# EAGLE design eCog101_I2C_TFT_.96 (EAGLE 6.6.0)
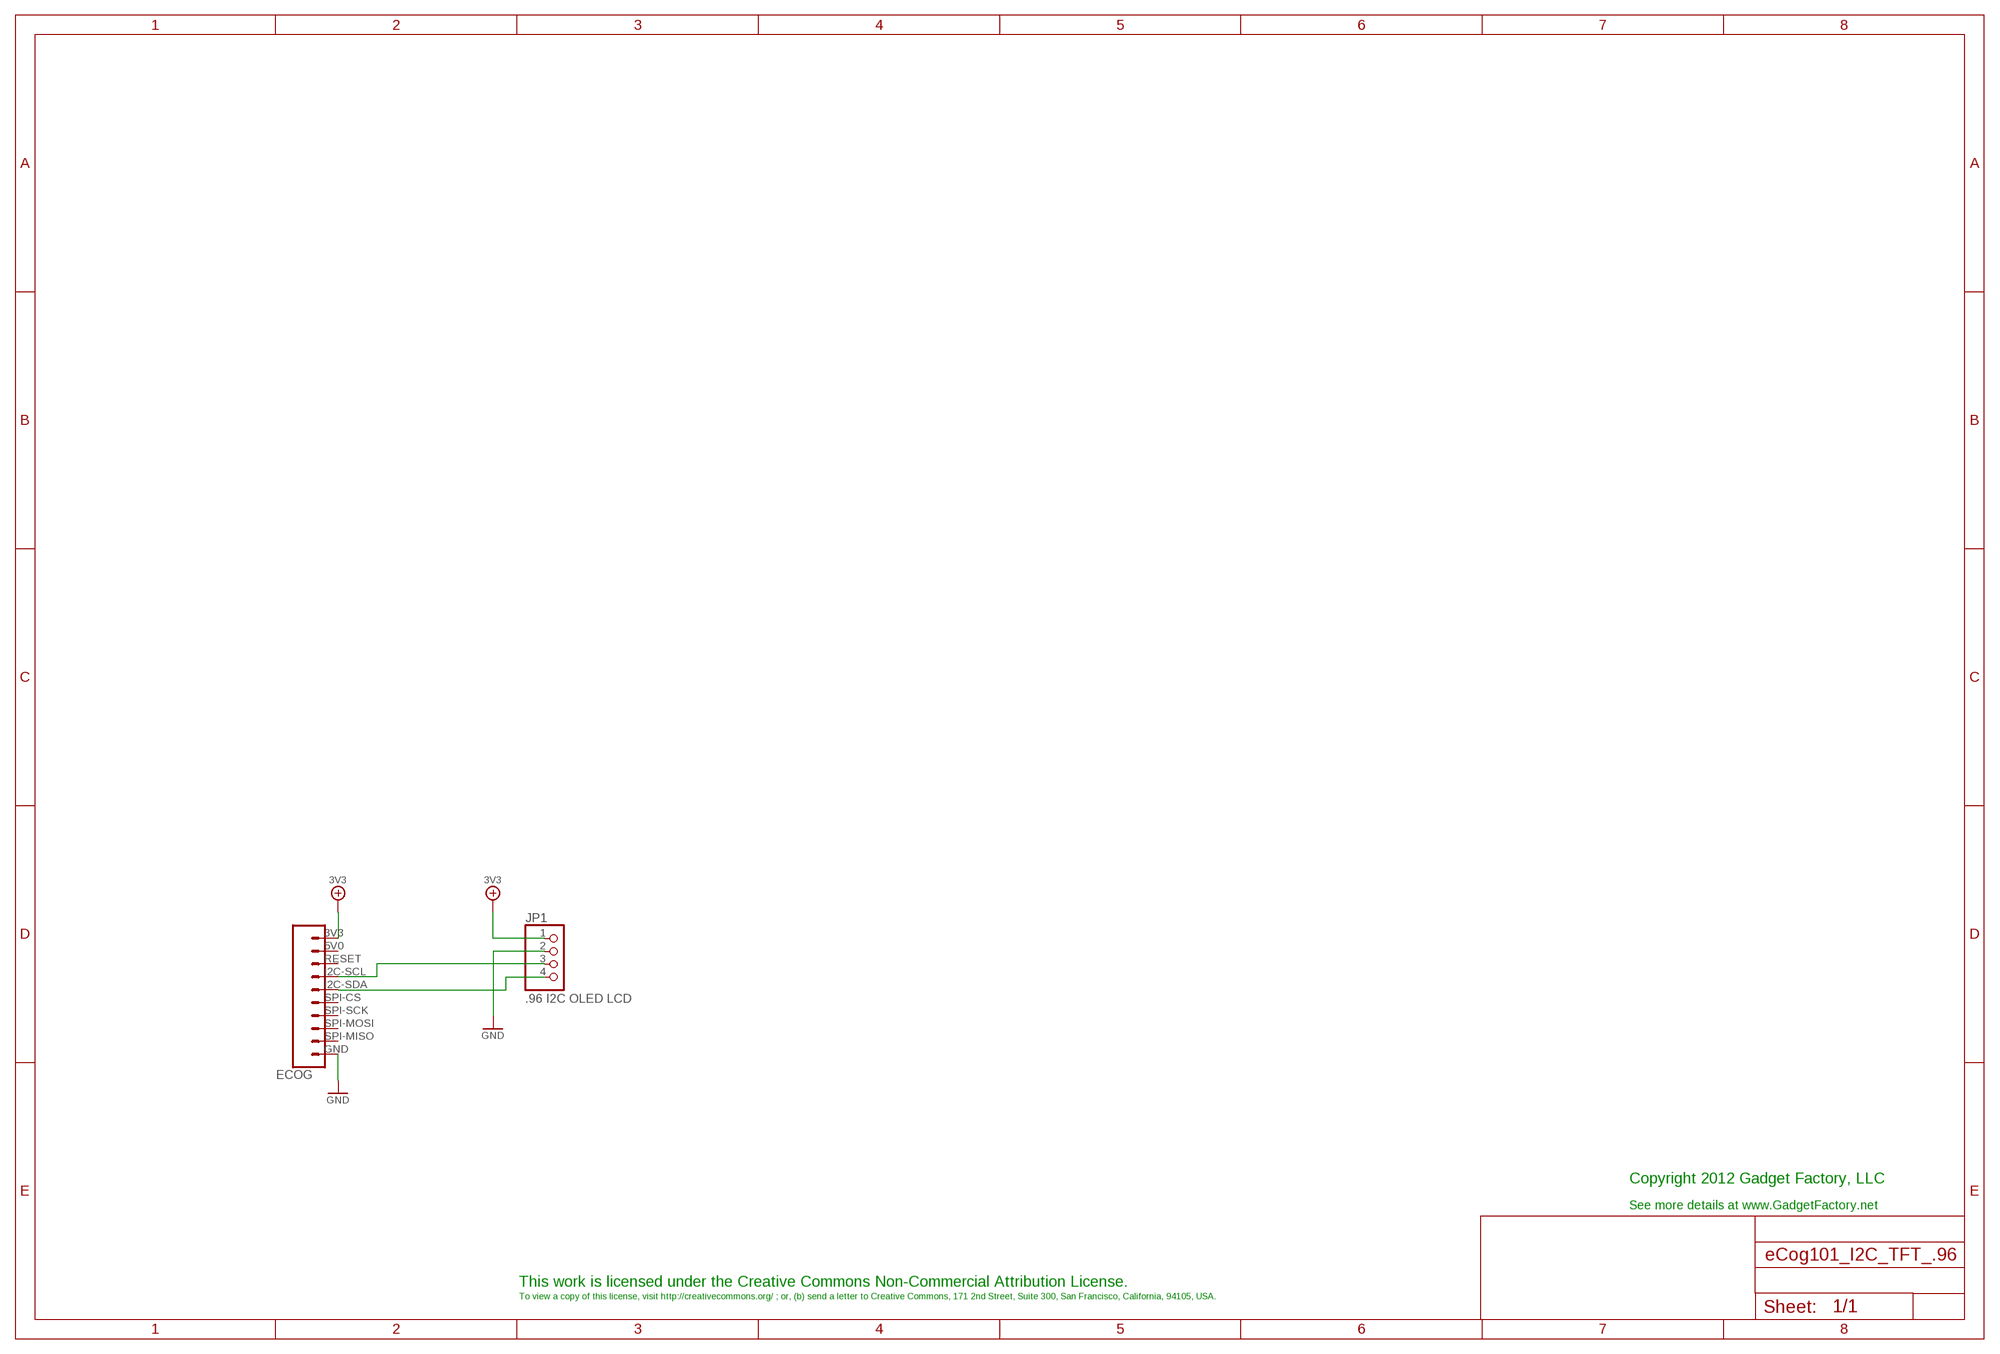
[diagram p0: schematic, sheet 1]

## Parts
ECOG  ECOG_BUSES_ROWECOG_BUSES_SMD  [ECOG_BUSES_SMD]
JP1  .96 I2C OLED LCD  PINHD-1X4  [1X04]

## Nets
3V3: ECOG.3V3 JP1.1
GND: ECOG.GND JP1.2
N$1: ECOG.I2C-SCL JP1.3
N$2: ECOG.I2C-SDA JP1.4
Unconnected: ECOG.5V0 ECOG.RESET ECOG.SPI-CS ECOG.SPI-MISO ECOG.SPI-MOSI ECOG.SPI-SCK

## Notes on the sheet
- Copyright 2012 Gadget Factory, LLC
- See more details at www.GadgetFactory.net
- This work is licensed under the Creative Commons Non-Commercial Attribution License.
- To view a copy of this license, visit http://creativecommons.org/ ; or, (b) send a letter to Creative Commons, 171 2nd Street, Suite 300, San Francisco, California, 94105, USA.

## Library data of the parts
ECOG = eCogs:ECOG_BUSES_ROW; DIGIKEY: S1013EC-10-ND
JP1 = pinhead:PINHD-1X4: PIN HEADER; DEALEXTREME: 419232

## Board
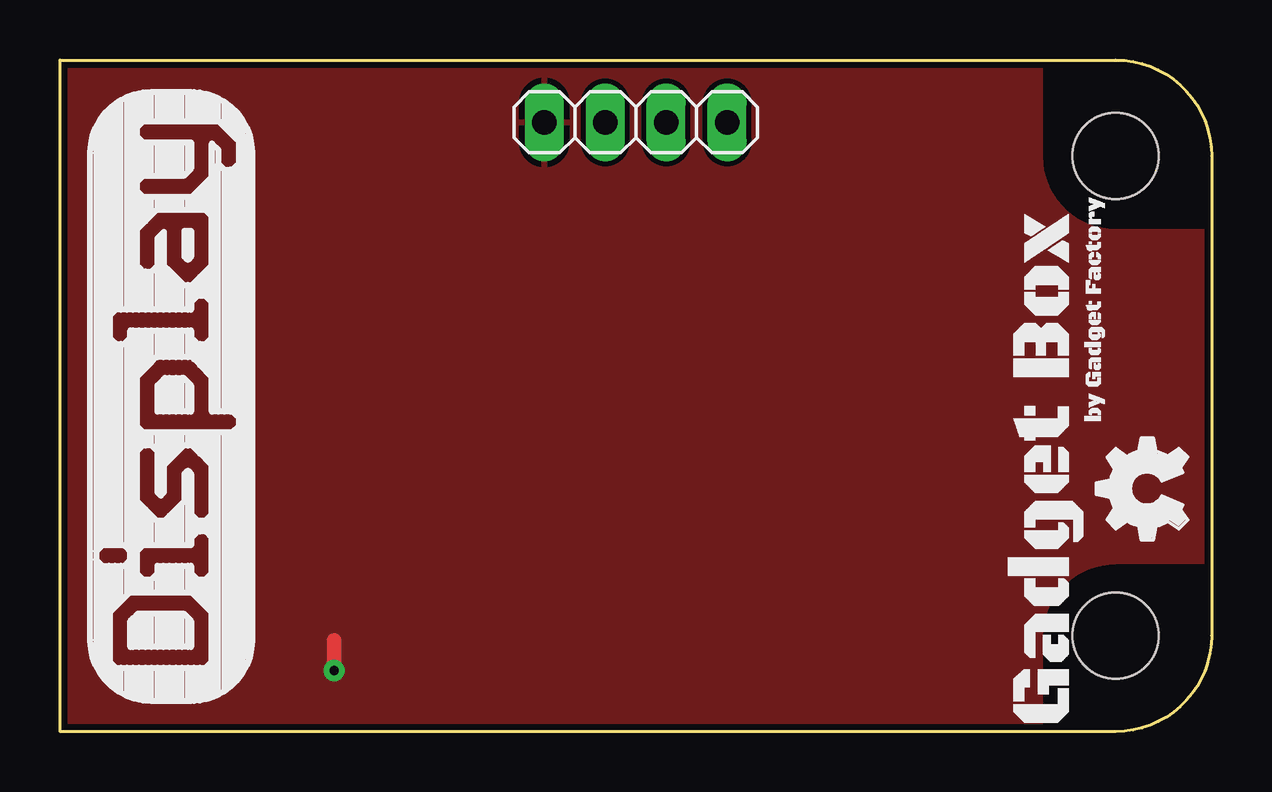
[diagram p1: board, top side]
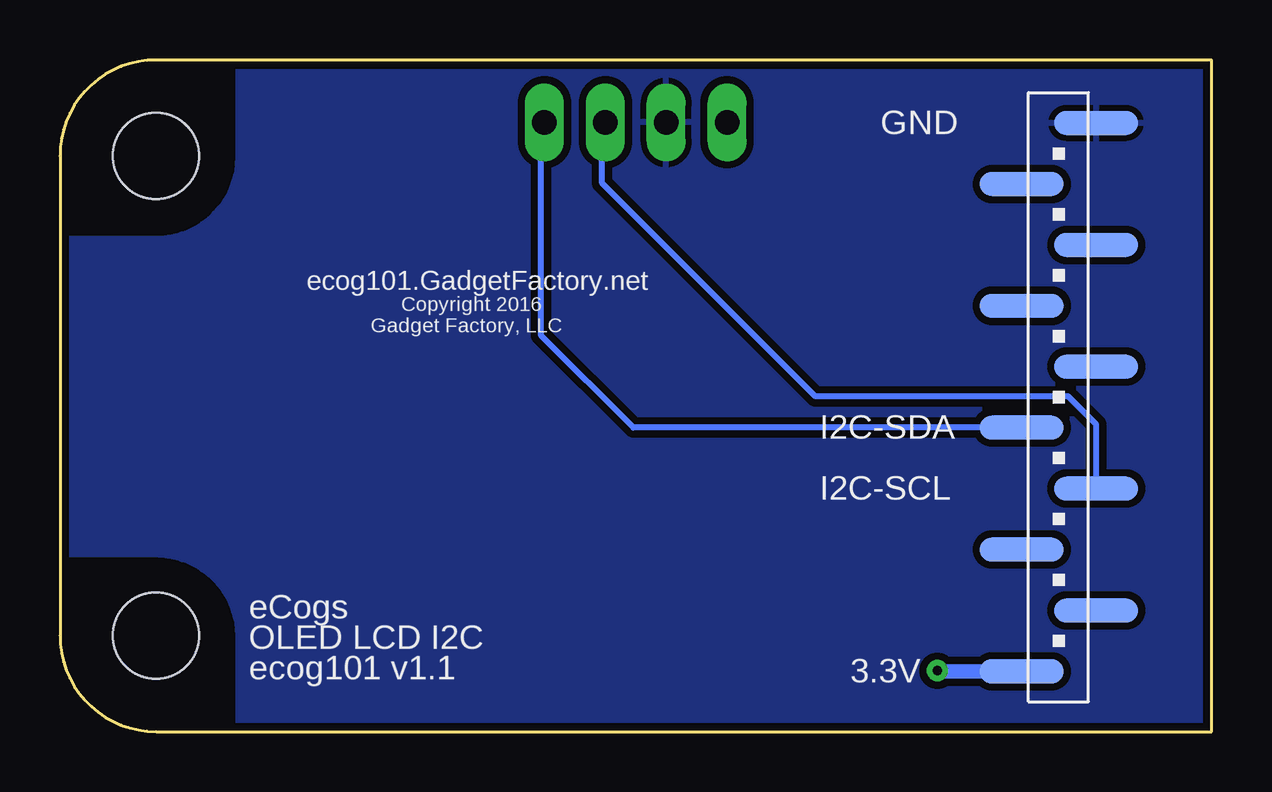
[diagram p2: board, bottom side, seen from below]

Size 48 x 28 mm. Coordinates in mm from the lower left corner, seen from the top.
Copper layers (1*16): Top 0.035mm / dielectric 1.5mm / Bottom 0.035mm
Design rules "SparkFun": minimum track width 8mil, minimum drill 20mil, track to track 8mil, track to pad 8mil, pad to pad 8mil, via to via 8mil, smd to smd 8mil, copper to edge 10mil, drill to drill 8mil, minimum pad ring 12mil, minimum via ring 10mil, stop-mask expansion 4mil, vias tented up to drill 25mil, thermal gap 10mil

### Footprints (pad centres in the part's own frame; a part is rotated, then mirrored left to right if it is on the bottom)
ECOG_BUSES_SMD = smd 3.5 x 1 bottom: 3V3 7.909,2.51; 5V0 4.811,5.05; GND 4.811,25.37; I2C-SCL 4.811,10.13; I2C-SDA 7.909,12.67; RESET 7.909,7.59; SPI-CS 4.811,15.21; SPI-MISO 7.909,22.83; SPI-MOSI 4.811,20.29; SPI-SCK 7.909,17.75 | hole 3.6: 44,4; 44,24
1X04 = drill 1.016 long: 1 -3.81,0; 2 -1.27,0; 3 1.27,0; 4 3.81,0

### Placement (x,y rotation side)
ECOG  0,0 0 top
JP1  24,25.4 0 top
U$1  [GADGETBOX_SMALL]  41.15,11.05 90 top
U$2  [OSHW_FILLX150_NOTEXT]  47,8 90 top

### Tracks (layer width: path | path; a pad name or v marks a point on that pad's centre or on a via)
3V3  (via drill 0.38)
  Top 0.61: v11.43,2.54 11.43,3.81
  Bottom 0.61: ECOG.3V3 11.4,2.51 v11.43,2.54
  pour Top: -1.27,29.27 49.27,29.27 49.27,-1.27 -1.27,-1.27
GND
  pour Bottom (isolate 0.305): -2.54,30.54 50.54,30.54 50.54,-2.54 -2.54,-2.54
N$1
  Bottom 0.254: ECOG.I2C-SCL 4.81,12.81 5.97,13.97 16.51,13.97 25.4,22.86 25.4,25.27 JP1.3
N$2
  Bottom 0.254: ECOG.I2C-SDA 24.1,12.67 27.94,16.51 27.94,25.27 JP1.4

### Text on the board
bPlace: GND | Copyright 2016 | ecog101.GadgetFactory.net | Gadget Factory, LLC | I2C-SDA | I2C-SCL | eCogs | OLED LCD I2C | 3.3V | ecog101 v1.1